# Altium project 大风车（STM32F1）.PrjPcb
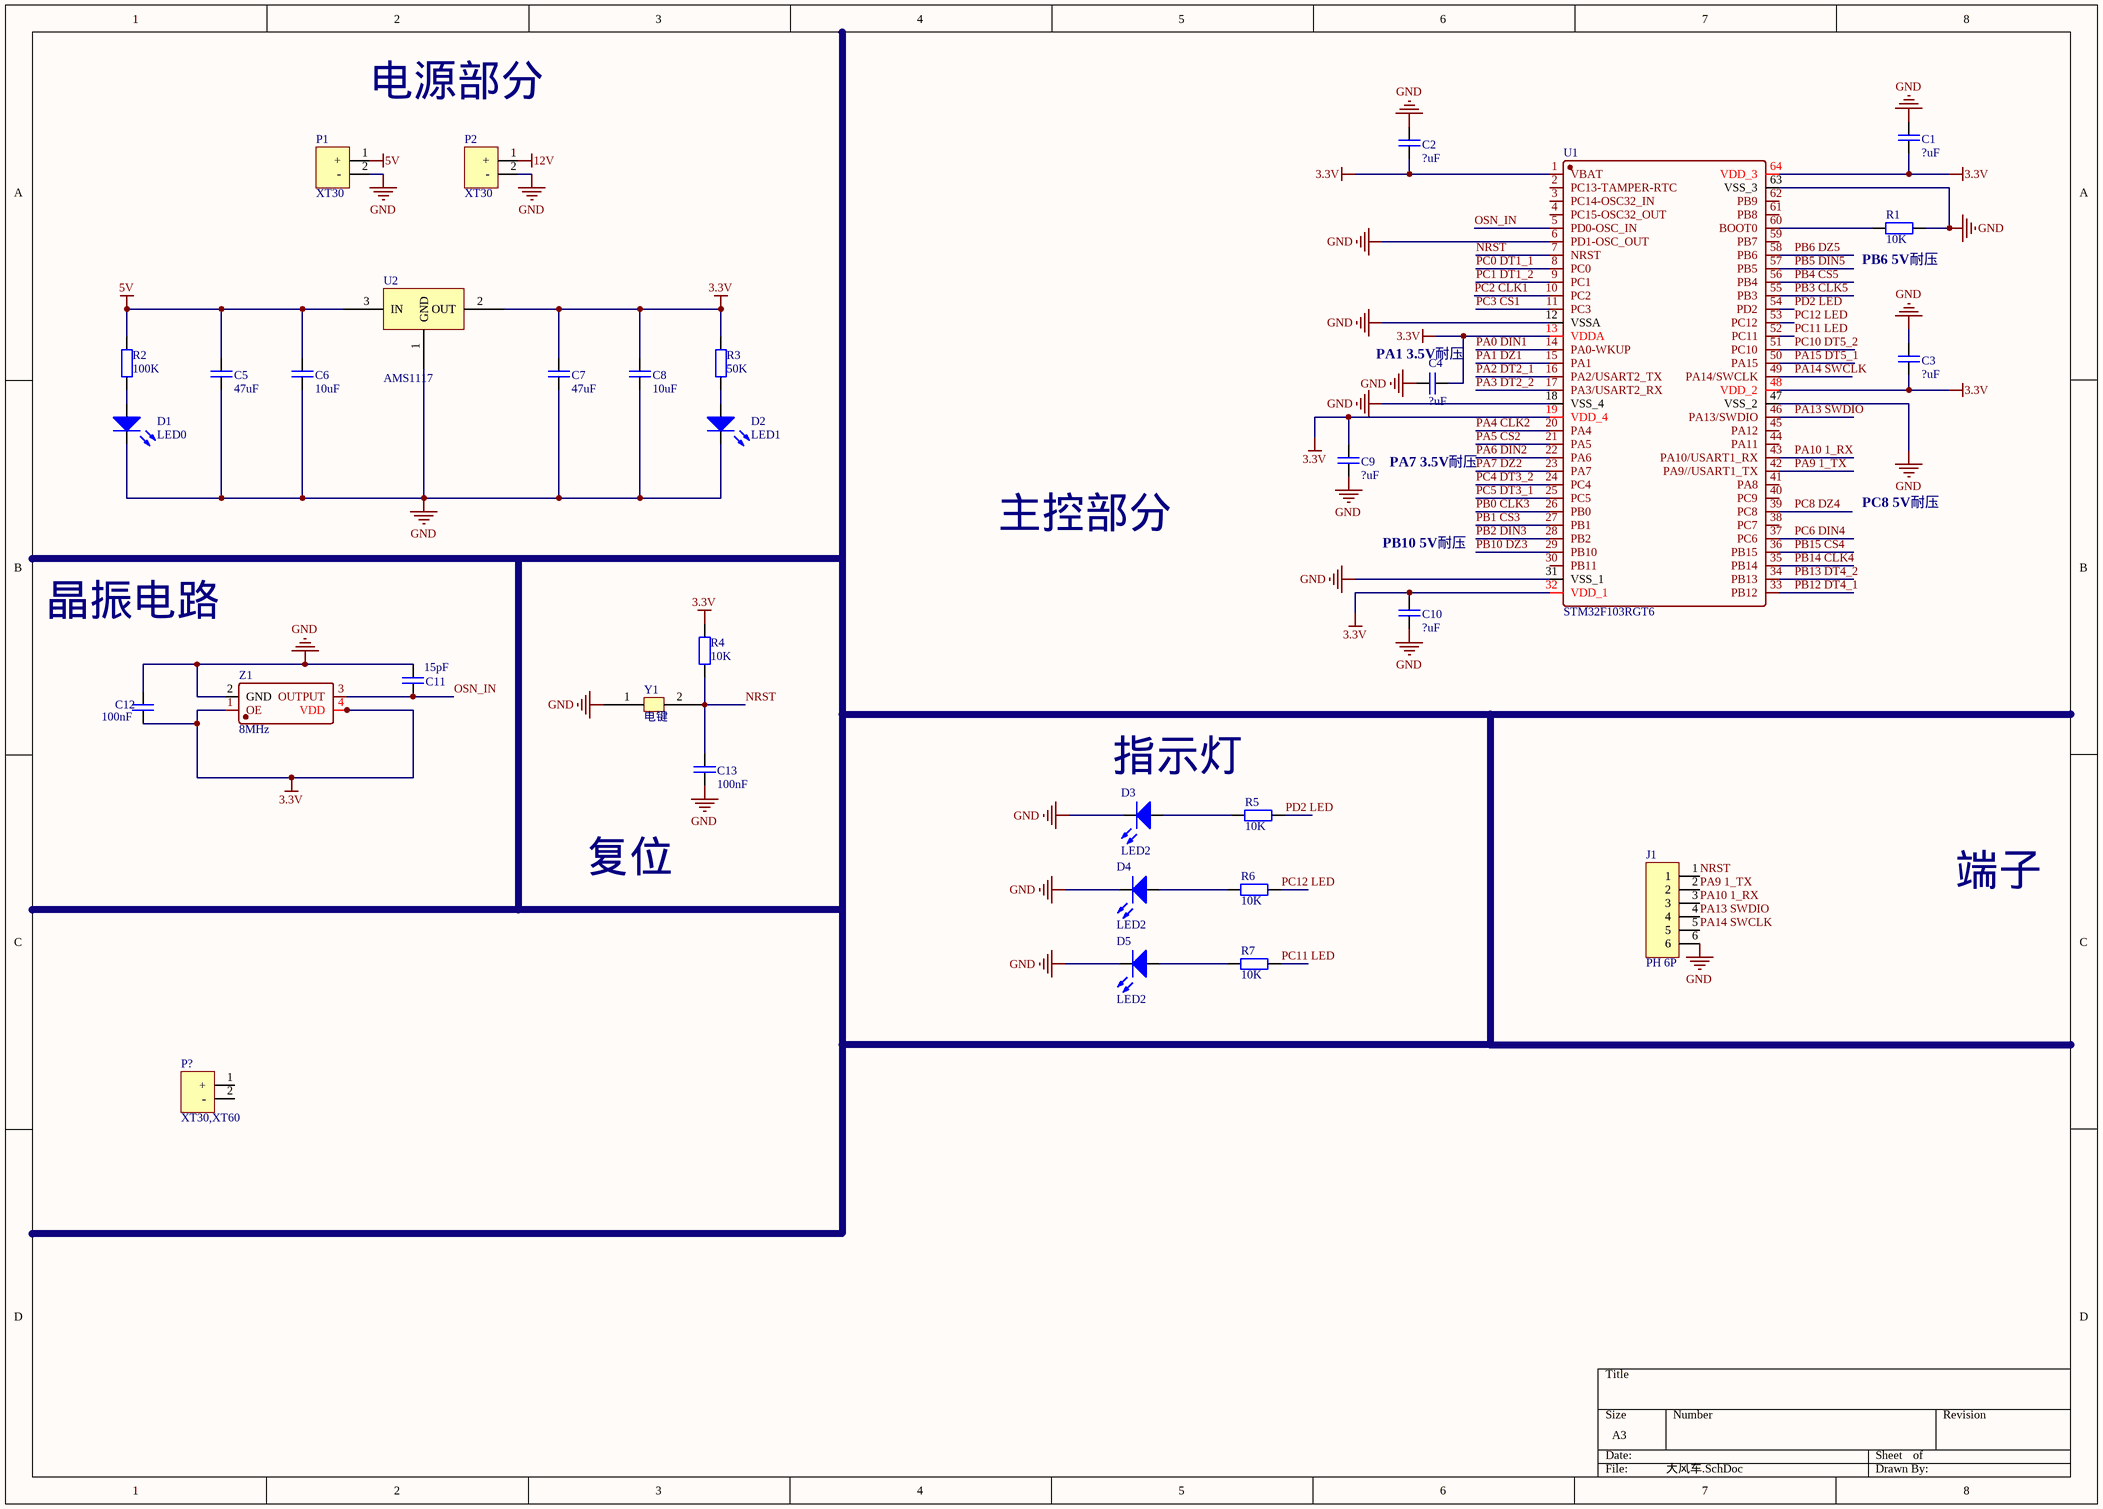
[diagram p0: 大风车.SchDoc]
4 sheets, 148 parts. Net scope: global (net labels, ports and power ports of the same name join across sheets).
Board files: 大风车.PcbDoc, 大风车第二版.PcbDoc, 大风车第三版.PcbDoc
Sheets:
  大风车.SchDoc
  大风车灯条.SchDoc
  大风车灯条1.SchDoc
  大风车灯条2.SchDoc

## Sheet 大风车.SchDoc
size A3

### Parts
C1  ?uF  [0603_C]
C2  ?uF  [0603_C]
C3  ?uF  [0603_C]
C4  ?uF  [0603_C]
C5  47uF  [1210_C]
C6  10uF  [1210_C]
C7  47uF  [1210_C]
C8  10uF  [1210_C]
C9  ?uF  [0603_C]
C10  ?uF  [0603_C]
C11  15pF  [0603_C]
C12  100nF  [0603_C]
C13  100nF  [0603_C]
D1  LED0  [LED-0603]
D2  LED1  [LED-0603]
D3  LED2  [LED-0603]
D4  LED2  [LED-0603]
D5  LED2  [LED-0603]
J1  PH 6P  [XH 6P 2.54mm 立 贴]
P1  XT30  [XT30-F]
P2  XT30  [XT30-F]
P?  XT30,XT60  [XT30-F]
R1  10K  [0603_R]
R2  100K  [0603_R]
R3  50K  [0603_R]
R4  10K  [0603_R]
R5  10K  [0603_R]
R6  10K  [0603_R]
R7  10K  [0603_R]
U1  STM32F103RGT6  [STM32F1]
U2  AMS1117  [AMS1117]
Y1  电键  [电键]
Z1  8MHz  [OSC-SMD_4P-L2.5-W2.0-BL]

### Nets
3.3V: C1.1 C2.1 C3.1 C4.1 C7.2 C8.2 C9.2 C10.2 C12.1 R3.2 R4.2 U1.1(VBAT) U1.13(VDDA) U1.19(VDD_4) U1.32(VDD_1) U1.48(VDD_2) U1.64(VDD_3) U2.2(OUT) Z1.1(OE) Z1.4(VDD)
5V: C5.2 C6.2 P1.1(+) R2.1 U2.3(IN)
12V: P2.1(+)
GND: C1.2 C2.2 C3.2 C4.2 C5.1 C6.1 C7.1 C8.1 C9.1 C10.1 C11.2 C12.2 C13.2 D1.2(K) D2.2(K) D3.2(K) D4.2(K) D5.2(K) J1.6 P1.2(-) P2.2(-) R1.2 U1.6(PD1-OSC_OUT) U1.12(VSSA) U1.18(VSS_4) U1.31(VSS_1) U1.47(VSS_2) U1.63(VSS_3) U2.1(GND) Y1.1 Z1.2(GND)
NRST: C13.1 J1.1 R4.1 U1.7(NRST) Y1.2
OSN_IN: C11.1 U1.5(PD0-OSC_IN) Z1.3(OUTPUT)
PA0 DIN1: U1.14(PA0-WKUP)
PA1 DZ1: U1.15(PA1)
PA2 DT2_1: U1.16(PA2/USART2_TX)
PA3 DT2_2: U1.17(PA3/USART2_RX)
PA4 CLK2: U1.20(PA4)
PA5 CS2: U1.21(PA5)
PA6 DIN2: U1.22(PA6)
PA7 DZ2: U1.23(PA7)
PA9 1_TX: J1.2 U1.42(PA9//USART1_TX)
PA10 1_RX: J1.3 U1.43(PA10/USART1_RX)
PA13 SWDIO: J1.4 U1.46(PA13/SWDIO)
PA14 SWCLK: J1.5 U1.49(PA14/SWCLK)
PA15 DT5_1: U1.50(PA15)
PB0 CLK3: U1.26(PB0)
PB1 CS3: U1.27(PB1)
PB2 DIN3: U1.28(PB2)
PB3 CLK5: U1.55(PB3)
PB4 CS5: U1.56(PB4)
PB5 DIN5: U1.57(PB5)
PB6 DZ5: U1.58(PB6)
PB10 DZ3: U1.29(PB10)
PB12 DT4_1: U1.33(PB12)
PB13 DT4_2: U1.34(PB13)
PB14 CLK4: U1.35(PB14)
PB15 CS4: U1.36(PB15)
PC0 DT1_1: U1.8(PC0)
PC1 DT1_2: U1.9(PC1)
PC2 CLK1: U1.10(PC2)
PC3 CS1: U1.11(PC3)
PC4 DT3_2: U1.24(PC4)
PC5 DT3_1: U1.25(PC5)
PC6 DIN4: U1.37(PC6)
PC8 DZ4: U1.39(PC8)
PC10 DT5_2: U1.51(PC10)
PC11 LED: R7.2 U1.52(PC11)
PC12 LED: R6.2 U1.53(PC12)
PD2 LED: R5.2 U1.54(PD2)
NetD1_1: D1.1(A) R2.2
NetD2_1: D2.1(A) R3.1
NetD3_1: D3.1(A) R5.1
NetD4_1: D4.1(A) R6.1
NetD5_1: D5.1(A) R7.1
NetR1_1: R1.1 U1.60(BOOT0)

Not connected (* = marked no-connect by the designer): P? 1(+) 2(-); U1 2(PC13-TAMPER-RTC) 3(PC14-OSC32_IN) 4(PC15-OSC32_OUT) 30(PB11) 38(PC7) 40(PC9) 41(PA8) 44(PA11) 45(PA12) 59(PB7) 61(PB8) 62(PB9)

### Notes on the sheet
- 电源部分
- (near R1) PB6 5V耐压
- (near C4) PA1 3.5V耐压
- (near C9) PA7 3.5V耐压
- PC8 5V耐压
- 主控部分
- PB10 5V耐压
- 晶振电路
- (near D3) 指示灯
- 复位
- 端子

### Library data of the parts
C1-C13 = Cap: Published: 8-Jun-2000; LatestRevisionDate: 17-Jul-2002; LatestRevisionNote: Re-released for DXP Platform.; PackageReference: RAD-0.3; Publisher: Altium Limited
D1-D5 = LED0: 发光二极管; Published: 8-Jun-2000; LatestRevisionDate: 08-Jul-2005; LatestRevisionNote: Mech Layer 1 removed.; PackageReference: LED-0; Publisher: Altium Limited
P? = XT: 电源接口
R1-R7 = Res: Published: 8-Jun-2000; LatestRevisionDate: 17-Jul-2002; LatestRevisionNote: Re-released for DXP Platform.; PackageReference: AXIAL-0.4; Publisher: Altium Limited

## Sheet 大风车灯条.SchDoc
size A4
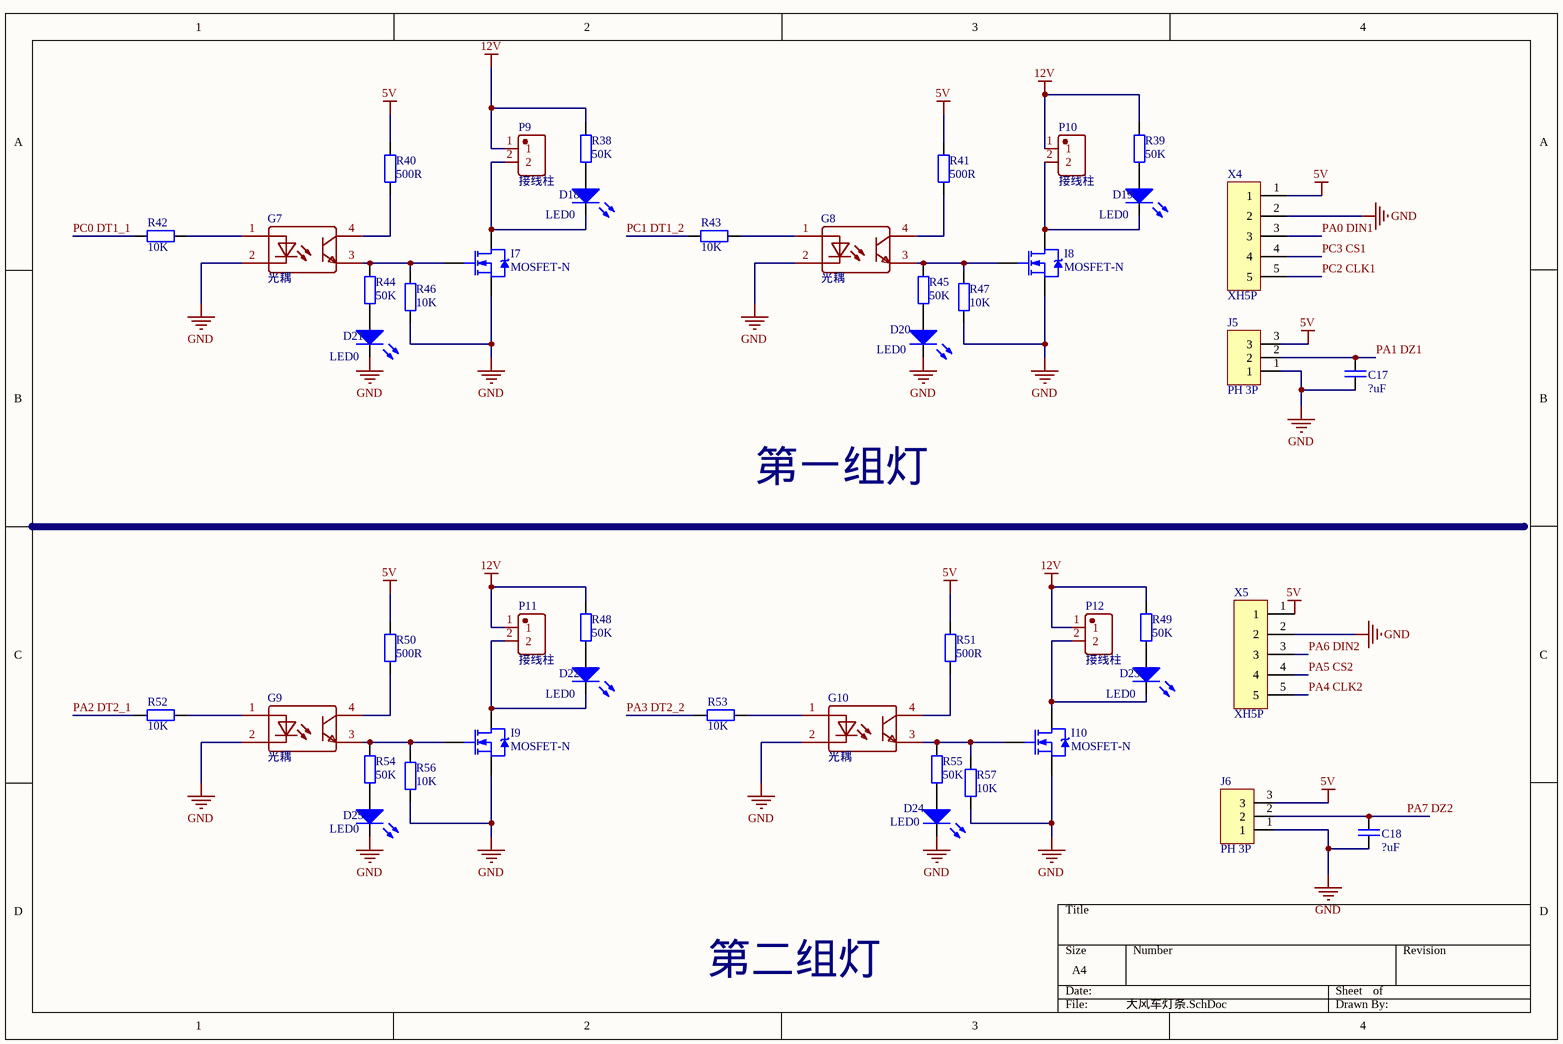
[diagram p1: 大风车灯条.SchDoc]

### Parts
C17  ?uF  [0603_C]
C18  ?uF  [0603_C]
D18  LED0  [LED-0603]
D19  LED0  [LED-0603]
D20  LED0  [LED-0603]
D21  LED0  [LED-0603]
D22  LED0  [LED-0603]
D23  LED0  [LED-0603]
D24  LED0  [LED-0603]
D25  LED0  [LED-0603]
G7  光耦  [SMD-4]
G8  光耦  [SMD-4]
G9  光耦  [SMD-4]
G10  光耦  [SMD-4]
I7  MOSFET-N  [VSONP-8]
I8  MOSFET-N  [VSONP-8]
I9  MOSFET-N  [VSONP-8]
I10  MOSFET-N  [VSONP-8]
J5  PH 3P  [PH3P]
J6  PH 3P  [PH3P]
P9  接线柱  [XT30-F]
P10  接线柱  [XT30-F]
P11  接线柱  [XT30-F]
P12  接线柱  [XT30-F]
R38  50K  [0603_R]
R39  50K  [0603_R]
R40  500R  [0603_R]
R41  500R  [0603_R]
R42  10K  [0603_R]
R43  10K  [0603_R]
R44  50K  [0603_R]
R45  50K  [0603_R]
R46  10K  [0603_R]
R47  10K  [0603_R]
R48  50K  [0603_R]
R49  50K  [0603_R]
R50  500R  [0603_R]
R51  500R  [0603_R]
R52  10K  [0603_R]
R53  10K  [0603_R]
R54  50K  [0603_R]
R55  50K  [0603_R]
R56  10K  [0603_R]
R57  10K  [0603_R]
X4  XH5P  [XH5P]
X5  XH5P  [XH5P]

### Nets
5V: J5.3 J6.3 R40.2 R41.2 R50.2 R51.2 X4.1 X5.1
12V: P9.1 P10.1 P11.1 P12.1 R38.2 R39.2 R48.2 R49.2
GND: C17.1 C18.1 D20.2(K) D21.2(K) D24.2(K) D25.2(K) G7.2(CAT) G8.2(CAT) G9.2(CAT) G10.2(CAT) I7.S I8.S I9.S I10.S J5.1 J6.1 R46.1 R47.1 R56.1 R57.1 X4.2 X5.2
PA0 DIN1: X4.3
PA1 DZ1: C17.2 J5.2
PA2 DT2_1: R52.1
PA3 DT2_2: R53.1
PA4 CLK2: X5.5
PA5 CS2: X5.4
PA6 DIN2: X5.3
PA7 DZ2: C18.2 J6.2
PC0 DT1_1: R42.1
PC1 DT1_2: R43.1
PC2 CLK1: X4.5
PC3 CS1: X4.4
NetD18_1: D18.1(A) R38.1
NetD18_2: D18.2(K) I7.D P9.2
NetD19_1: D19.1(A) R39.1
NetD19_2: D19.2(K) I8.D P10.2
NetD20_1: D20.1(A) R45.1
NetD21_1: D21.1(A) R44.1
NetD22_1: D22.1(A) R48.1
NetD22_2: D22.2(K) I9.D P11.2
NetD23_1: D23.1(A) R49.1
NetD23_2: D23.2(K) I10.D P12.2
NetD24_1: D24.1(A) R55.1
NetD25_1: D25.1(A) R54.1
NetG7_1: G7.1(AN) R42.2
NetG7_3: G7.3(EM) I7.G R44.2 R46.2
NetG7_4: G7.4(COL) R40.1
NetG8_1: G8.1(AN) R43.2
NetG8_3: G8.3(EM) I8.G R45.2 R47.2
NetG8_4: G8.4(COL) R41.1
NetG9_1: G9.1(AN) R52.2
NetG9_3: G9.3(EM) I9.G R54.2 R56.2
NetG9_4: G9.4(COL) R50.1
NetG10_1: G10.1(AN) R53.2
NetG10_3: G10.3(EM) I10.G R55.2 R57.2
NetG10_4: G10.4(COL) R51.1

### Notes on the sheet
- 第一组灯
- 第二组灯

### Library data of the parts
C17 C18 = Cap: Published: 8-Jun-2000; LatestRevisionDate: 17-Jul-2002; LatestRevisionNote: Re-released for DXP Platform.; PackageReference: RAD-0.3; Publisher: Altium Limited
D18-D25 = LED0: 发光二极管; Published: 8-Jun-2000; LatestRevisionDate: 08-Jul-2005; LatestRevisionNote: Mech Layer 1 removed.; PackageReference: LED-0; Publisher: Altium Limited
R38-R57 = Res: Published: 8-Jun-2000; LatestRevisionDate: 17-Jul-2002; LatestRevisionNote: Re-released for DXP Platform.; PackageReference: AXIAL-0.4; Publisher: Altium Limited

## Sheet 大风车灯条1.SchDoc
size A4
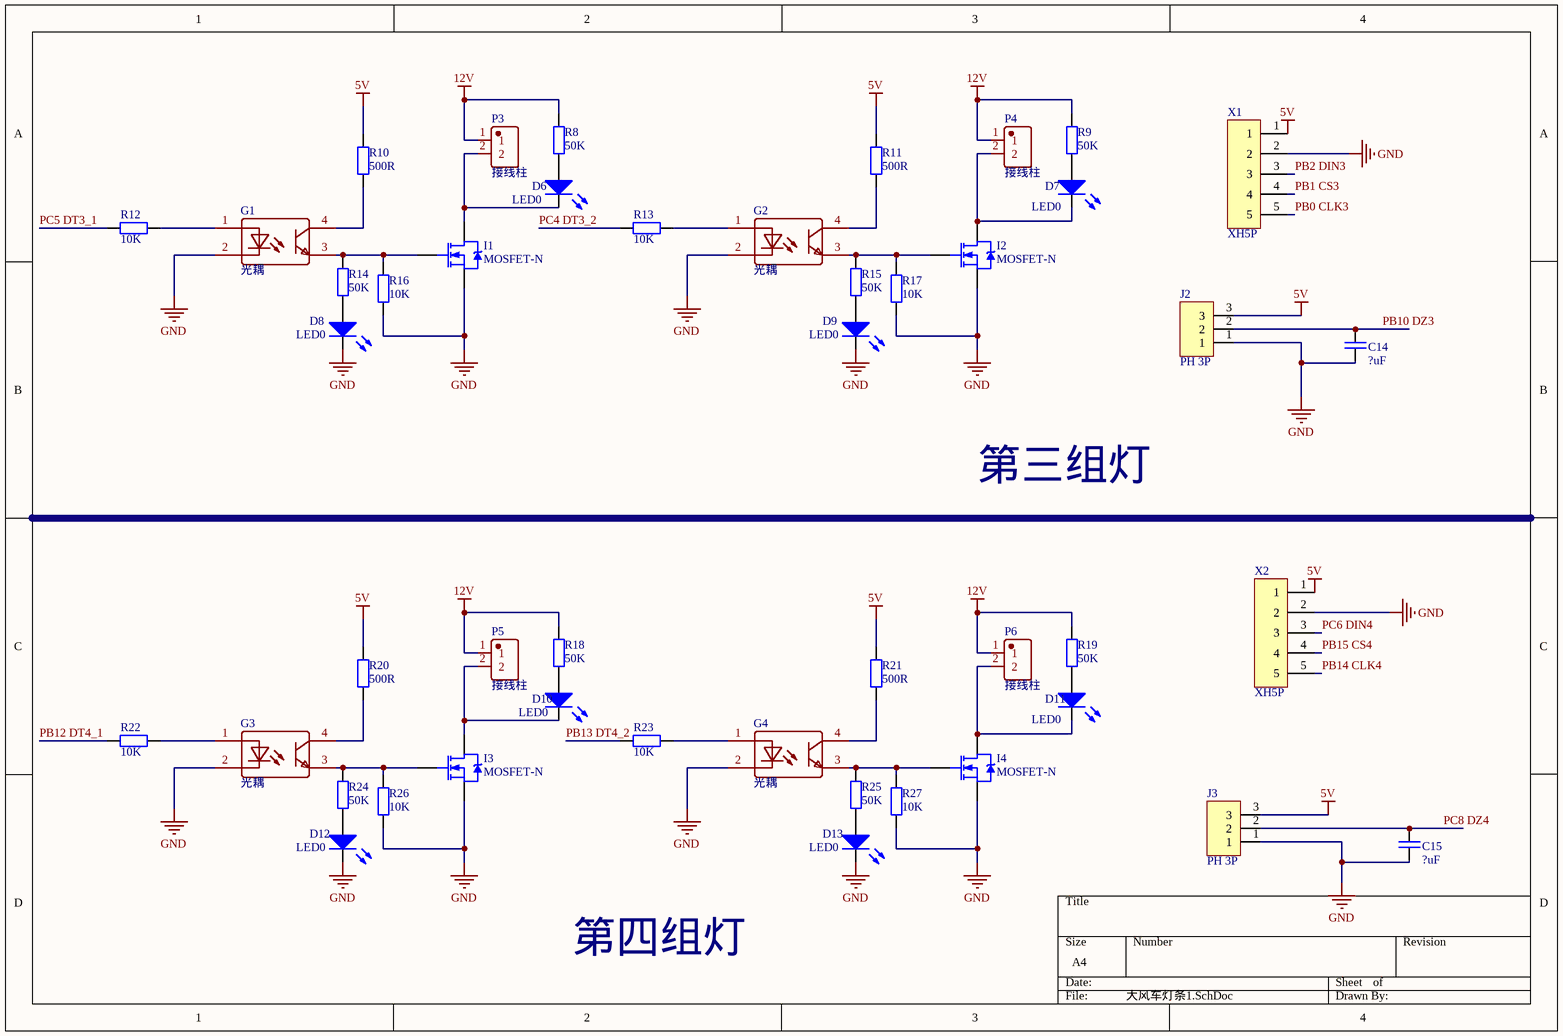
[diagram p2: 大风车灯条1.SchDoc]

### Parts
C14  ?uF  [0603_C]
C15  ?uF  [0603_C]
D6  LED0  [LED-0603]
D7  LED0  [LED-0603]
D8  LED0  [LED-0603]
D9  LED0  [LED-0603]
D10  LED0  [LED-0603]
D11  LED0  [LED-0603]
D12  LED0  [LED-0603]
D13  LED0  [LED-0603]
G1  光耦  [SMD-4]
G2  光耦  [SMD-4]
G3  光耦  [SMD-4]
G4  光耦  [SMD-4]
I1  MOSFET-N  [VSONP-8]
I2  MOSFET-N  [VSONP-8]
I3  MOSFET-N  [VSONP-8]
I4  MOSFET-N  [VSONP-8]
J2  PH 3P  [PH3P]
J3  PH 3P  [PH3P]
P3  接线柱  [XT30-F]
P4  接线柱  [XT30-F]
P5  接线柱  [XT30-F]
P6  接线柱  [XT30-F]
R8  50K  [0603_R]
R9  50K  [0603_R]
R10  500R  [0603_R]
R11  500R  [0603_R]
R12  10K  [0603_R]
R13  10K  [0603_R]
R14  50K  [0603_R]
R15  50K  [0603_R]
R16  10K  [0603_R]
R17  10K  [0603_R]
R18  50K  [0603_R]
R19  50K  [0603_R]
R20  500R  [0603_R]
R21  500R  [0603_R]
R22  10K  [0603_R]
R23  10K  [0603_R]
R24  50K  [0603_R]
R25  50K  [0603_R]
R26  10K  [0603_R]
R27  10K  [0603_R]
X1  XH5P  [XH5P]
X2  XH5P  [XH5P]

### Nets
5V: J2.3 J3.3 R10.2 R11.2 R20.2 R21.2 X1.1 X2.1
12V: P3.1 P4.1 P5.1 P6.1 R8.2 R9.2 R18.2 R19.2
GND: C14.1 C15.1 D8.2(K) D9.2(K) D12.2(K) D13.2(K) G1.2(CAT) G2.2(CAT) G3.2(CAT) G4.2(CAT) I1.S I2.S I3.S I4.S J2.1 J3.1 R16.1 R17.1 R26.1 R27.1 X1.2 X2.2
PB0 CLK3: X1.5
PB1 CS3: X1.4
PB2 DIN3: X1.3
PB10 DZ3: C14.2 J2.2
PB12 DT4_1: R22.1
PB13 DT4_2: R23.1
PB14 CLK4: X2.5
PB15 CS4: X2.4
PC4 DT3_2: R13.1
PC5 DT3_1: R12.1
PC6 DIN4: X2.3
PC8 DZ4: C15.2 J3.2
NetD6_1: D6.1(A) R8.1
NetD6_2: D6.2(K) I1.D P3.2
NetD7_1: D7.1(A) R9.1
NetD7_2: D7.2(K) I2.D P4.2
NetD8_1: D8.1(A) R14.1
NetD9_1: D9.1(A) R15.1
NetD10_1: D10.1(A) R18.1
NetD10_2: D10.2(K) I3.D P5.2
NetD11_1: D11.1(A) R19.1
NetD11_2: D11.2(K) I4.D P6.2
NetD12_1: D12.1(A) R24.1
NetD13_1: D13.1(A) R25.1
NetG1_1: G1.1(AN) R12.2
NetG1_3: G1.3(EM) I1.G R14.2 R16.2
NetG1_4: G1.4(COL) R10.1
NetG2_1: G2.1(AN) R13.2
NetG2_3: G2.3(EM) I2.G R15.2 R17.2
NetG2_4: G2.4(COL) R11.1
NetG3_1: G3.1(AN) R22.2
NetG3_3: G3.3(EM) I3.G R24.2 R26.2
NetG3_4: G3.4(COL) R20.1
NetG4_1: G4.1(AN) R23.2
NetG4_3: G4.3(EM) I4.G R25.2 R27.2
NetG4_4: G4.4(COL) R21.1

### Notes on the sheet
- 第三组灯
- 第四组灯

### Library data of the parts
C14 C15 = Cap: Published: 8-Jun-2000; LatestRevisionDate: 17-Jul-2002; LatestRevisionNote: Re-released for DXP Platform.; PackageReference: RAD-0.3; Publisher: Altium Limited
D6-D13 = LED0: 发光二极管; Published: 8-Jun-2000; LatestRevisionDate: 08-Jul-2005; LatestRevisionNote: Mech Layer 1 removed.; PackageReference: LED-0; Publisher: Altium Limited
R8-R27 = Res: Published: 8-Jun-2000; LatestRevisionDate: 17-Jul-2002; LatestRevisionNote: Re-released for DXP Platform.; PackageReference: AXIAL-0.4; Publisher: Altium Limited

## Sheet 大风车灯条2.SchDoc
size A4
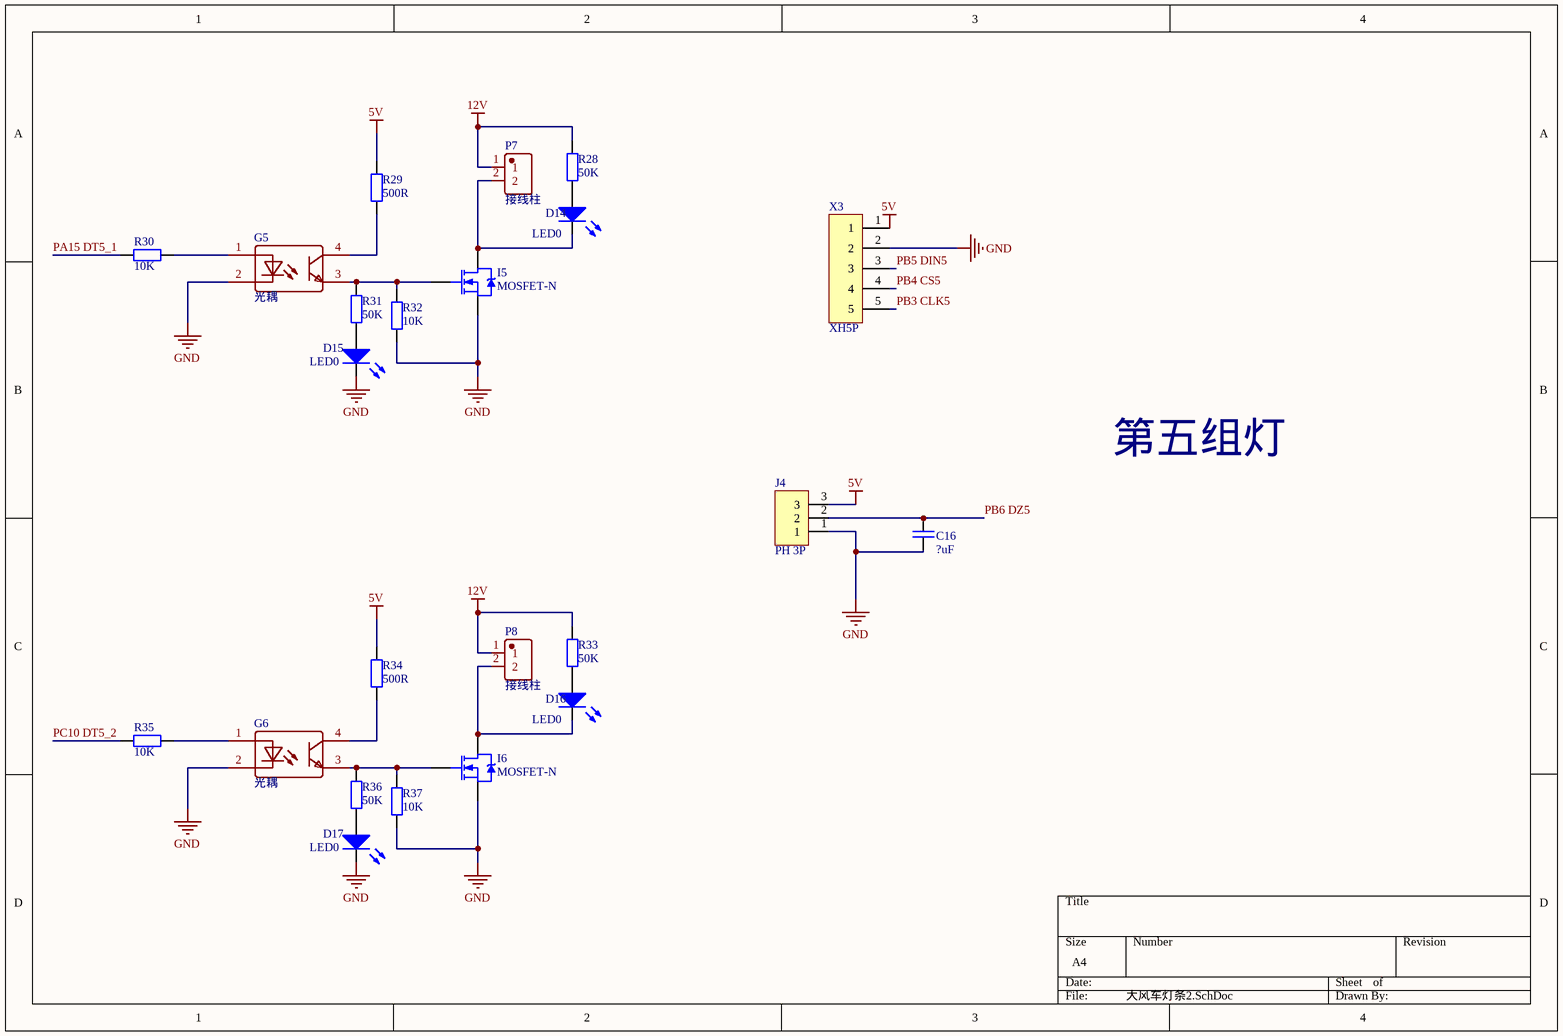
[diagram p3: 大风车灯条2.SchDoc]

### Parts
C16  ?uF  [0603_C]
D14  LED0  [LED-0603]
D15  LED0  [LED-0603]
D16  LED0  [LED-0603]
D17  LED0  [LED-0603]
G5  光耦  [SMD-4]
G6  光耦  [SMD-4]
I5  MOSFET-N  [VSONP-8]
I6  MOSFET-N  [VSONP-8]
J4  PH 3P  [PH3P]
P7  接线柱  [XT30-F]
P8  接线柱  [XT30-F]
R28  50K  [0603_R]
R29  500R  [0603_R]
R30  10K  [0603_R]
R31  50K  [0603_R]
R32  10K  [0603_R]
R33  50K  [0603_R]
R34  500R  [0603_R]
R35  10K  [0603_R]
R36  50K  [0603_R]
R37  10K  [0603_R]
X3  XH5P  [XH5P]

### Nets
5V: J4.3 R29.2 R34.2 X3.1
12V: P7.1 P8.1 R28.2 R33.2
GND: C16.1 D15.2(K) D17.2(K) G5.2(CAT) G6.2(CAT) I5.S I6.S J4.1 R32.1 R37.1 X3.2
PA15 DT5_1: R30.1
PB3 CLK5: X3.5
PB4 CS5: X3.4
PB5 DIN5: X3.3
PB6 DZ5: C16.2 J4.2
PC10 DT5_2: R35.1
NetD14_1: D14.1(A) R28.1
NetD14_2: D14.2(K) I5.D P7.2
NetD15_1: D15.1(A) R31.1
NetD16_1: D16.1(A) R33.1
NetD16_2: D16.2(K) I6.D P8.2
NetD17_1: D17.1(A) R36.1
NetG5_1: G5.1(AN) R30.2
NetG5_3: G5.3(EM) I5.G R31.2 R32.2
NetG5_4: G5.4(COL) R29.1
NetG6_1: G6.1(AN) R35.2
NetG6_3: G6.3(EM) I6.G R36.2 R37.2
NetG6_4: G6.4(COL) R34.1

### Notes on the sheet
- 第五组灯

### Library data of the parts
C16 = Cap: Published: 8-Jun-2000; LatestRevisionDate: 17-Jul-2002; LatestRevisionNote: Re-released for DXP Platform.; PackageReference: RAD-0.3; Publisher: Altium Limited
D14-D17 = LED0: 发光二极管; Published: 8-Jun-2000; LatestRevisionDate: 08-Jul-2005; LatestRevisionNote: Mech Layer 1 removed.; PackageReference: LED-0; Publisher: Altium Limited
R28-R37 = Res: Published: 8-Jun-2000; LatestRevisionDate: 17-Jul-2002; LatestRevisionNote: Re-released for DXP Platform.; PackageReference: AXIAL-0.4; Publisher: Altium Limited

## Nets that join several sheets
5V: 大风车 (5 pins), 大风车灯条 (8 pins), 大风车灯条1 (8 pins), 大风车灯条2 (J4.3 R29.2 R34.2 X3.1)
12V: 大风车 (P2.1), 大风车灯条 (8 pins), 大风车灯条1 (8 pins), 大风车灯条2 (P7.1 P8.1 R28.2 R33.2)
GND: 大风车 (31 pins), 大风车灯条 (22 pins), 大风车灯条1 (22 pins), 大风车灯条2 (11 pins)
PA0 DIN1: 大风车 (U1.14), 大风车灯条 (X4.3)
PA1 DZ1: 大风车 (U1.15), 大风车灯条 (C17.2 J5.2)
PA2 DT2_1: 大风车 (U1.16), 大风车灯条 (R52.1)
PA3 DT2_2: 大风车 (U1.17), 大风车灯条 (R53.1)
PA4 CLK2: 大风车 (U1.20), 大风车灯条 (X5.5)
PA5 CS2: 大风车 (U1.21), 大风车灯条 (X5.4)
PA6 DIN2: 大风车 (U1.22), 大风车灯条 (X5.3)
PA7 DZ2: 大风车 (U1.23), 大风车灯条 (C18.2 J6.2)
PA15 DT5_1: 大风车 (U1.50), 大风车灯条2 (R30.1)
PB0 CLK3: 大风车 (U1.26), 大风车灯条1 (X1.5)
PB1 CS3: 大风车 (U1.27), 大风车灯条1 (X1.4)
PB2 DIN3: 大风车 (U1.28), 大风车灯条1 (X1.3)
PB3 CLK5: 大风车 (U1.55), 大风车灯条2 (X3.5)
PB4 CS5: 大风车 (U1.56), 大风车灯条2 (X3.4)
PB5 DIN5: 大风车 (U1.57), 大风车灯条2 (X3.3)
PB6 DZ5: 大风车 (U1.58), 大风车灯条2 (C16.2 J4.2)
PB10 DZ3: 大风车 (U1.29), 大风车灯条1 (C14.2 J2.2)
PB12 DT4_1: 大风车 (U1.33), 大风车灯条1 (R22.1)
PB13 DT4_2: 大风车 (U1.34), 大风车灯条1 (R23.1)
PB14 CLK4: 大风车 (U1.35), 大风车灯条1 (X2.5)
PB15 CS4: 大风车 (U1.36), 大风车灯条1 (X2.4)
PC0 DT1_1: 大风车 (U1.8), 大风车灯条 (R42.1)
PC1 DT1_2: 大风车 (U1.9), 大风车灯条 (R43.1)
PC2 CLK1: 大风车 (U1.10), 大风车灯条 (X4.5)
PC3 CS1: 大风车 (U1.11), 大风车灯条 (X4.4)
PC4 DT3_2: 大风车 (U1.24), 大风车灯条1 (R13.1)
PC5 DT3_1: 大风车 (U1.25), 大风车灯条1 (R12.1)
PC6 DIN4: 大风车 (U1.37), 大风车灯条1 (X2.3)
PC8 DZ4: 大风车 (U1.39), 大风车灯条1 (C15.2 J3.2)
PC10 DT5_2: 大风车 (U1.51), 大风车灯条2 (R35.1)